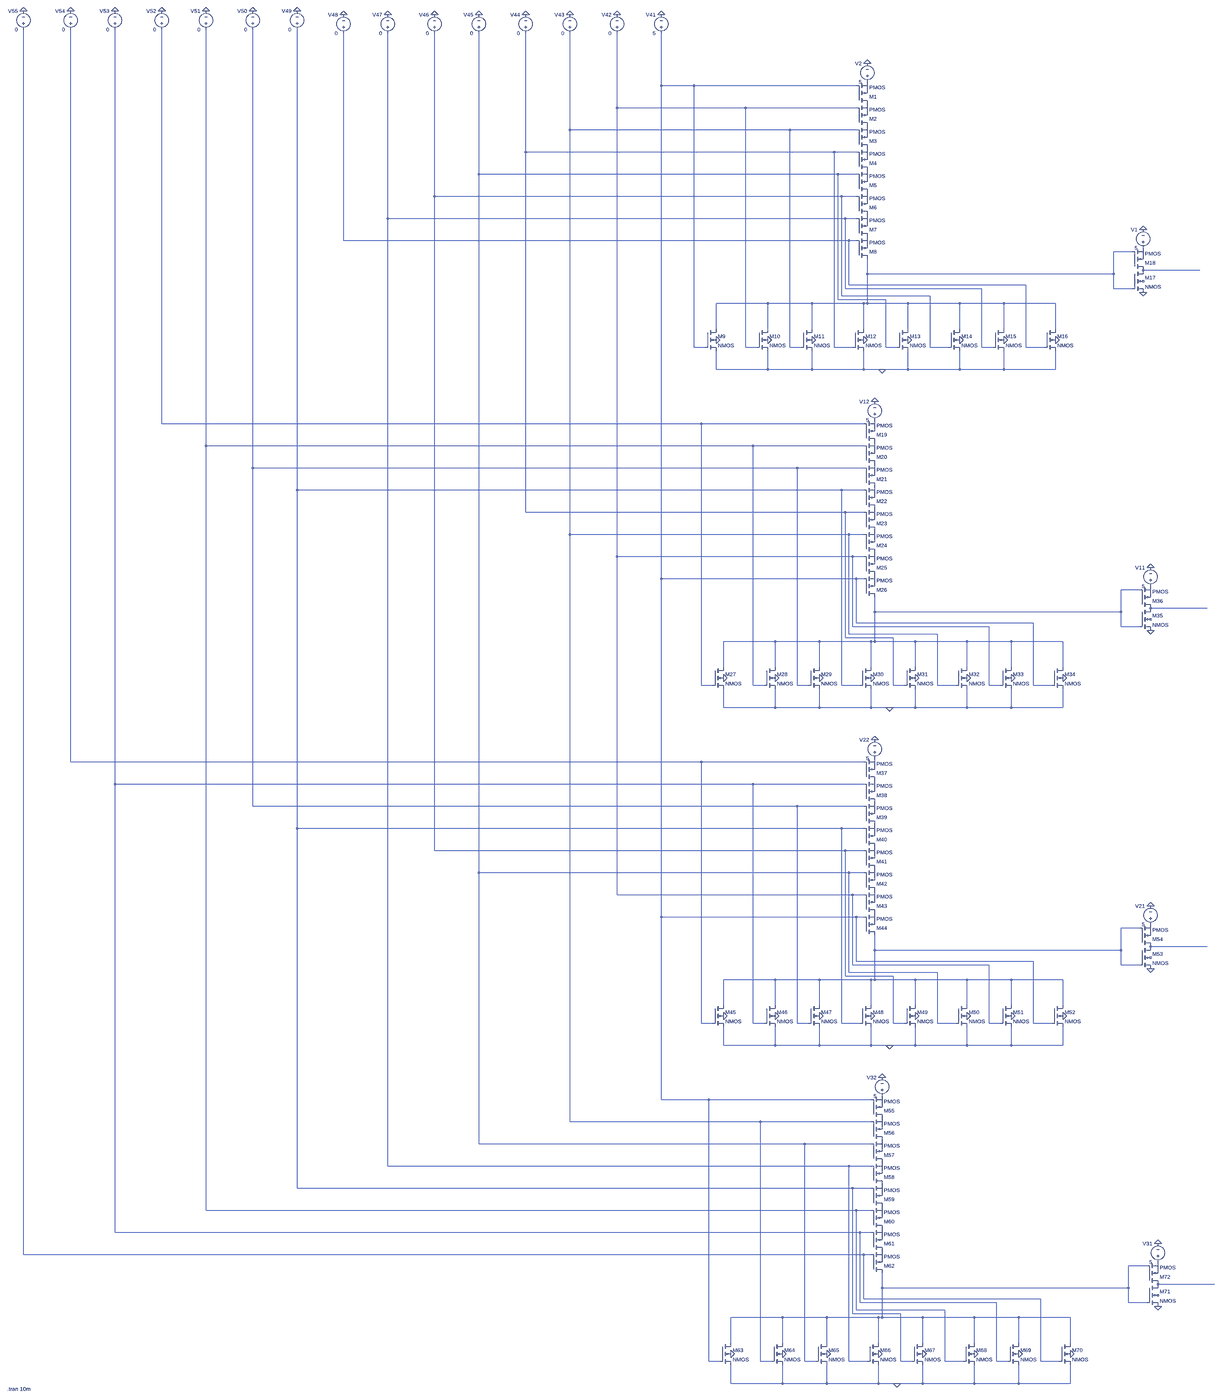
[diagram p0: schematic total.asc, whole sheet]
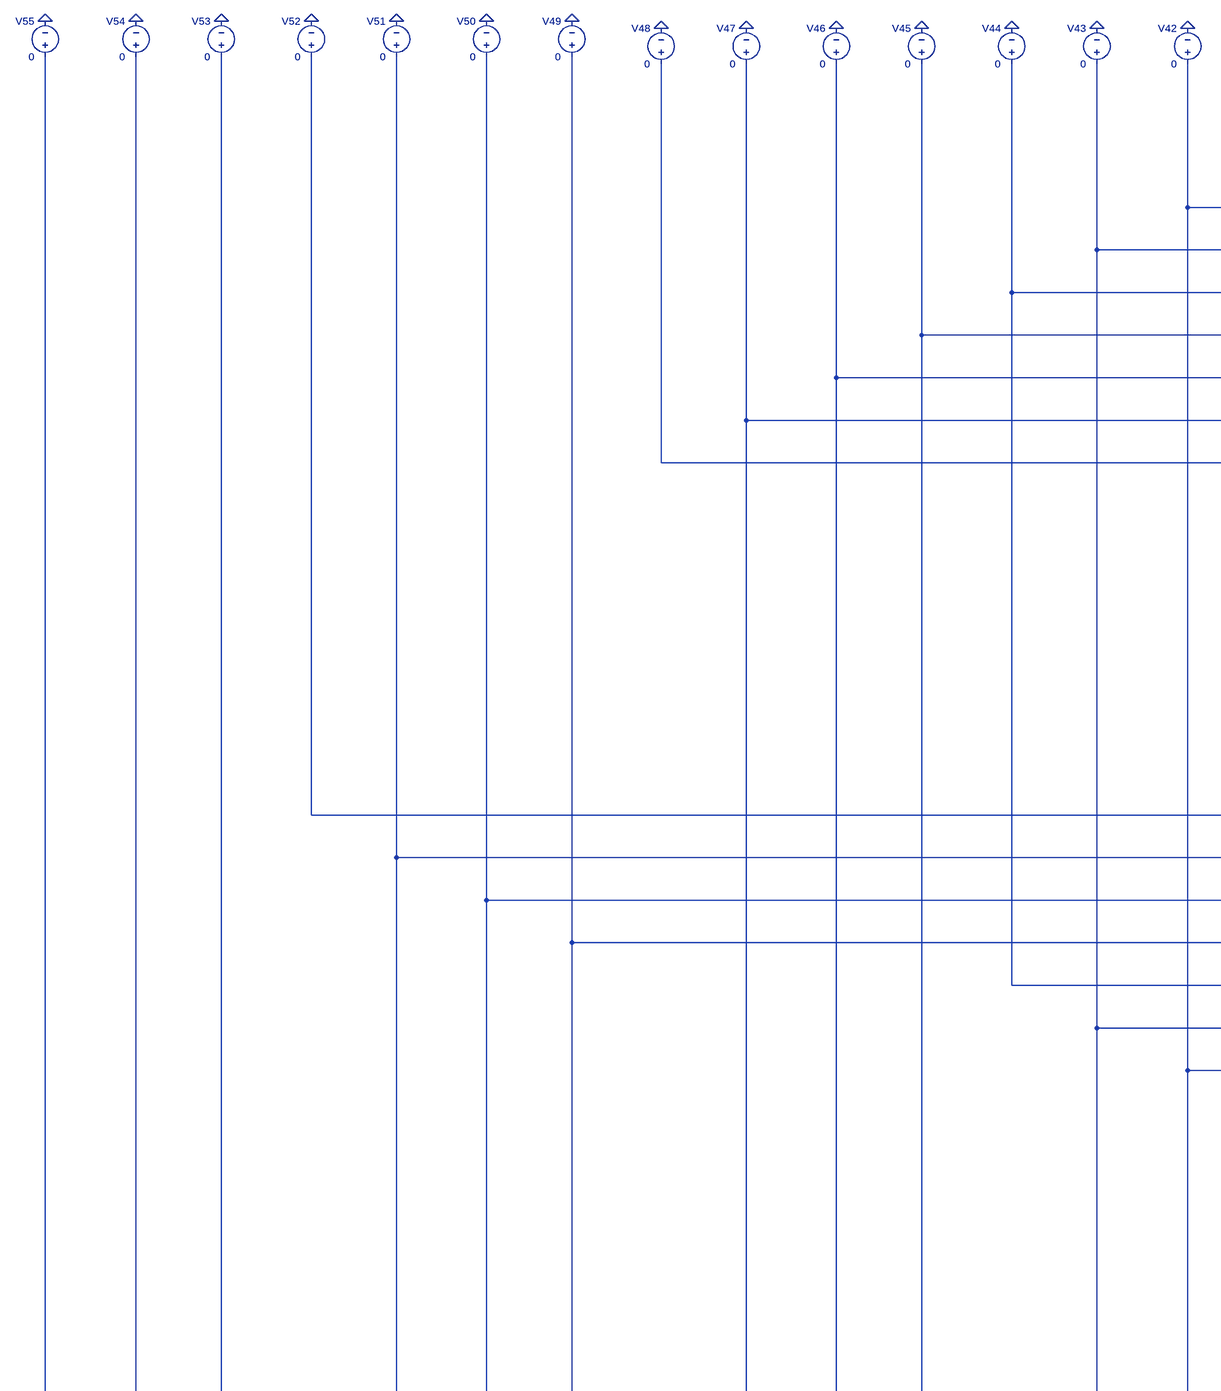
[diagram p1: schematic total.asc, part, row 1 of 2, column 1 of 2]
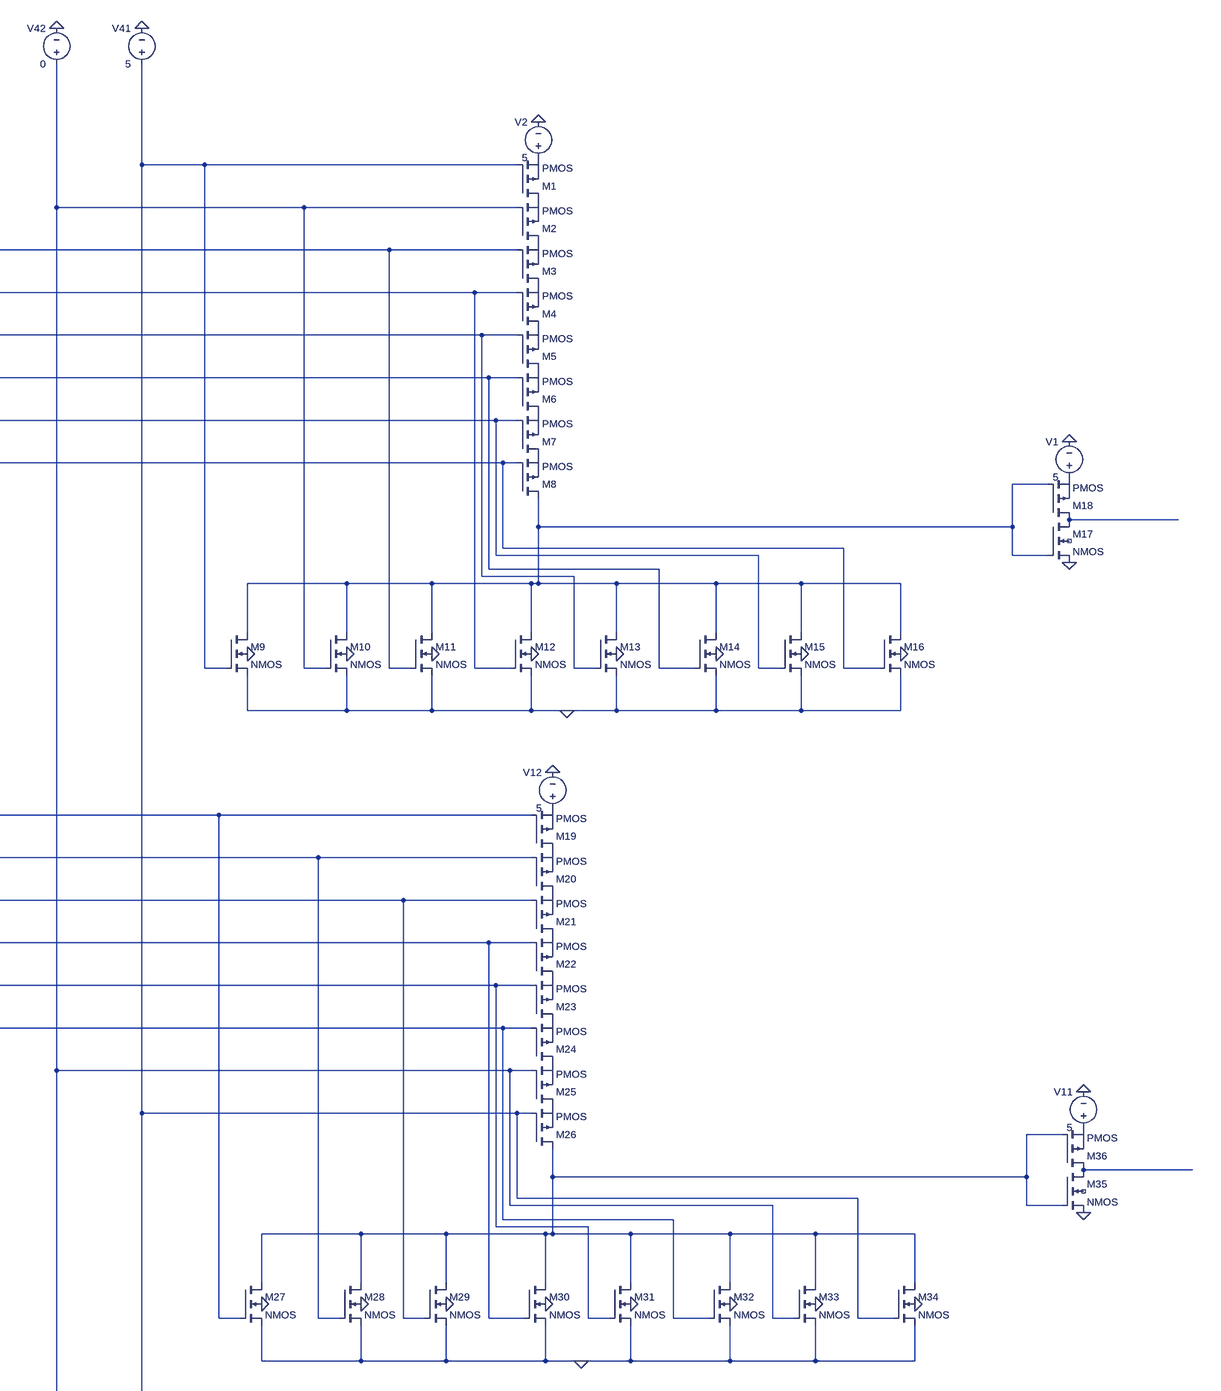
[diagram p2: schematic total.asc, part, row 1 of 2, column 2 of 2]
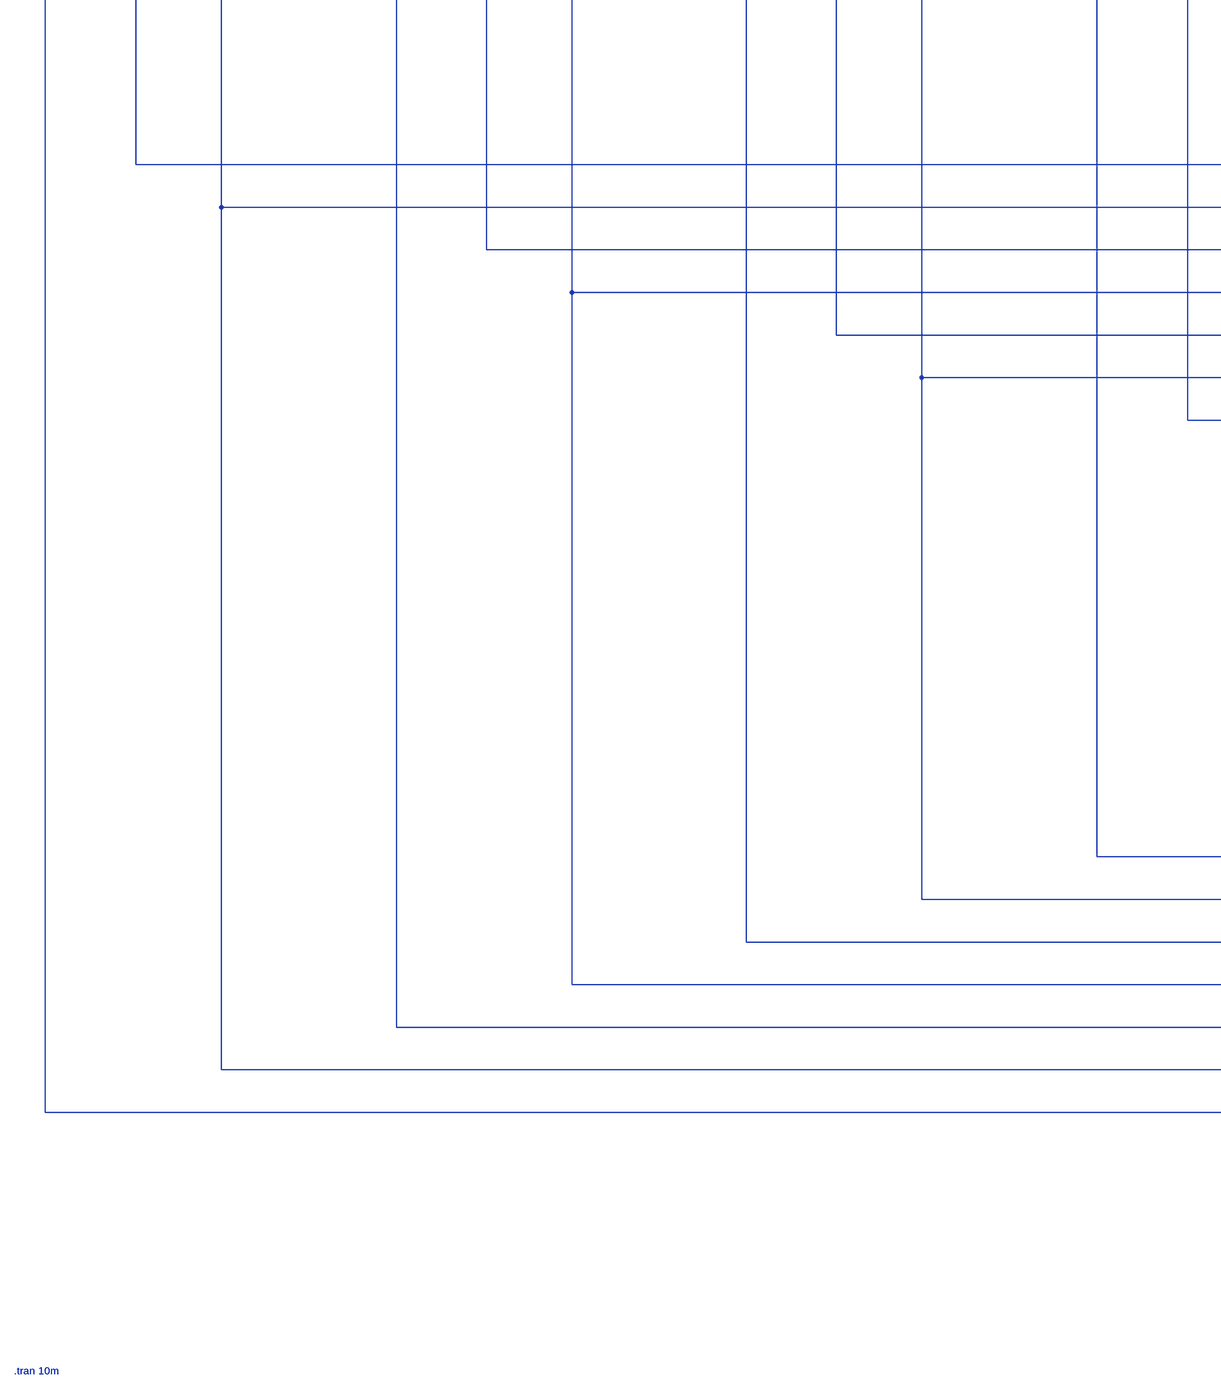
[diagram p3: schematic total.asc, part, row 2 of 2, column 1 of 2]
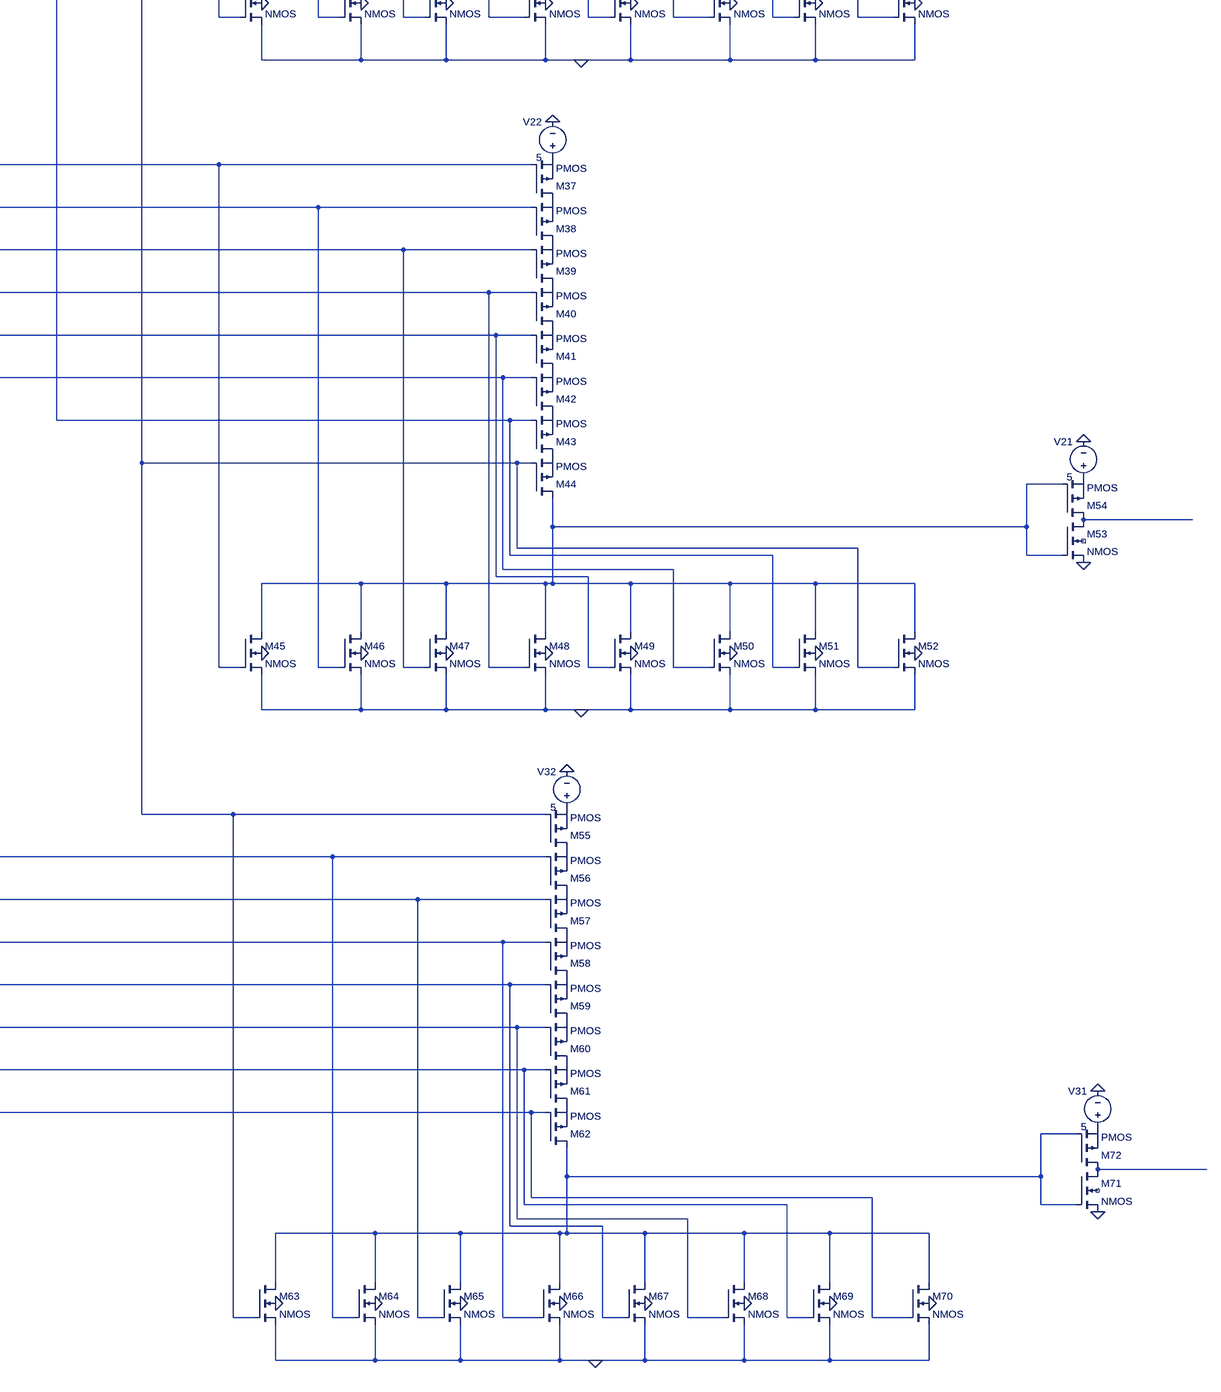
[diagram p4: schematic total.asc, part, row 2 of 2, column 2 of 2]
total.asc, the LTspice schematic file:
Version 4
SHEET 1 2260 6148
WIRE -1600 -384 -1600 -640
WIRE -448 -384 -1600 -384
WIRE 256 -384 -448 -384
WIRE -1792 -288 -1792 -640
WIRE -224 -288 -1792 -288
WIRE 256 -288 -224 -288
WIRE -2000 -192 -2000 -640
WIRE -32 -192 -2000 -192
WIRE 256 -192 -32 -192
WIRE -2192 -96 -2192 -640
WIRE 160 -96 -2192 -96
WIRE 256 -96 160 -96
WIRE -2400 0 -2400 -640
WIRE 176 0 -2400 0
WIRE 256 0 176 0
WIRE -2592 96 -2592 -640
WIRE 192 96 -2592 96
WIRE 256 96 192 96
WIRE -2800 192 -2800 -640
WIRE 208 192 -2800 192
WIRE 256 192 208 192
WIRE -2992 288 -2992 -640
WIRE 224 288 -2992 288
WIRE 256 288 224 288
WIRE 1856 336 1776 336
WIRE 2192 416 1904 416
WIRE 304 432 304 368
WIRE 1776 432 1776 336
WIRE 1776 432 304 432
WIRE 224 480 224 288
WIRE 992 480 224 480
WIRE 208 496 208 192
WIRE 800 496 208 496
WIRE 1776 496 1776 432
WIRE 1856 496 1776 496
WIRE 192 528 192 96
WIRE 576 528 192 528
WIRE 176 544 176 0
WIRE 384 544 176 544
WIRE -128 560 -352 560
WIRE 64 560 -128 560
WIRE 288 560 64 560
WIRE 304 560 304 432
WIRE 304 560 288 560
WIRE 480 560 304 560
WIRE 704 560 480 560
WIRE 896 560 704 560
WIRE 1120 560 896 560
WIRE -352 672 -352 560
WIRE -128 672 -128 560
WIRE 64 672 64 560
WIRE 288 672 288 560
WIRE 480 672 480 560
WIRE 704 672 704 560
WIRE 896 672 896 560
WIRE 1120 672 1120 560
WIRE -448 752 -448 -384
WIRE -400 752 -448 752
WIRE -224 752 -224 -288
WIRE -176 752 -224 752
WIRE -32 752 -32 -192
WIRE 16 752 -32 752
WIRE 160 752 160 -96
WIRE 240 752 160 752
WIRE 384 752 384 544
WIRE 432 752 384 752
WIRE 576 752 576 528
WIRE 656 752 576 752
WIRE 800 752 800 496
WIRE 848 752 800 752
WIRE 992 752 992 480
WIRE 1072 752 992 752
WIRE -352 848 -352 768
WIRE -128 848 -128 768
WIRE -128 848 -352 848
WIRE 64 848 64 768
WIRE 64 848 -128 848
WIRE 288 848 288 768
WIRE 288 848 64 848
WIRE 368 848 288 848
WIRE 480 848 480 768
WIRE 480 848 368 848
WIRE 704 848 704 768
WIRE 704 848 480 848
WIRE 896 848 896 768
WIRE 896 848 704 848
WIRE 1120 848 1120 768
WIRE 1120 848 896 848
WIRE -3792 1296 -3792 -656
WIRE -416 1296 -3792 1296
WIRE 288 1296 -416 1296
WIRE -3600 1392 -3600 -656
WIRE -192 1392 -3600 1392
WIRE 288 1392 -192 1392
WIRE -3392 1488 -3392 -656
WIRE 0 1488 -3392 1488
WIRE 288 1488 0 1488
WIRE -3200 1584 -3200 -656
WIRE 192 1584 -3200 1584
WIRE 288 1584 192 1584
WIRE -2192 1680 -2192 -96
WIRE 208 1680 -2192 1680
WIRE 288 1680 208 1680
WIRE -2000 1776 -2000 -192
WIRE 224 1776 -2000 1776
WIRE 288 1776 224 1776
WIRE -1792 1872 -1792 -288
WIRE 240 1872 -1792 1872
WIRE 288 1872 240 1872
WIRE -1600 1968 -1600 -384
WIRE 256 1968 -1600 1968
WIRE 288 1968 256 1968
WIRE 1888 2016 1808 2016
WIRE 2224 2096 1936 2096
WIRE 336 2112 336 2048
WIRE 1808 2112 1808 2016
WIRE 1808 2112 336 2112
WIRE 256 2160 256 1968
WIRE 1024 2160 256 2160
WIRE 240 2176 240 1872
WIRE 832 2176 240 2176
WIRE 1808 2176 1808 2112
WIRE 1888 2176 1808 2176
WIRE 224 2208 224 1776
WIRE 608 2208 224 2208
WIRE 208 2224 208 1680
WIRE 416 2224 208 2224
WIRE -96 2240 -320 2240
WIRE 96 2240 -96 2240
WIRE 320 2240 96 2240
WIRE 336 2240 336 2112
WIRE 336 2240 320 2240
WIRE 512 2240 336 2240
WIRE 736 2240 512 2240
WIRE 928 2240 736 2240
WIRE 1152 2240 928 2240
WIRE -320 2352 -320 2240
WIRE -96 2352 -96 2240
WIRE 96 2352 96 2240
WIRE 320 2352 320 2240
WIRE 512 2352 512 2240
WIRE 736 2352 736 2240
WIRE 928 2352 928 2240
WIRE 1152 2352 1152 2240
WIRE -416 2432 -416 1296
WIRE -368 2432 -416 2432
WIRE -192 2432 -192 1392
WIRE -144 2432 -192 2432
WIRE 0 2432 0 1488
WIRE 48 2432 0 2432
WIRE 192 2432 192 1584
WIRE 272 2432 192 2432
WIRE 416 2432 416 2224
WIRE 464 2432 416 2432
WIRE 608 2432 608 2208
WIRE 688 2432 608 2432
WIRE 832 2432 832 2176
WIRE 880 2432 832 2432
WIRE 1024 2432 1024 2160
WIRE 1104 2432 1024 2432
WIRE -320 2528 -320 2448
WIRE -96 2528 -96 2448
WIRE -96 2528 -320 2528
WIRE 96 2528 96 2448
WIRE 96 2528 -96 2528
WIRE 320 2528 320 2448
WIRE 320 2528 96 2528
WIRE 400 2528 320 2528
WIRE 512 2528 512 2448
WIRE 512 2528 400 2528
WIRE 736 2528 736 2448
WIRE 736 2528 512 2528
WIRE 928 2528 928 2448
WIRE 928 2528 736 2528
WIRE 1152 2528 1152 2448
WIRE 1152 2528 928 2528
WIRE -4192 2960 -4192 -656
WIRE -416 2960 -4192 2960
WIRE 288 2960 -416 2960
WIRE -4000 3056 -4000 -656
WIRE -192 3056 -4000 3056
WIRE 288 3056 -192 3056
WIRE -3392 3152 -3392 1488
WIRE 0 3152 -3392 3152
WIRE 288 3152 0 3152
WIRE -3200 3248 -3200 1584
WIRE 192 3248 -3200 3248
WIRE 288 3248 192 3248
WIRE -2592 3344 -2592 96
WIRE 208 3344 -2592 3344
WIRE 288 3344 208 3344
WIRE -2400 3440 -2400 0
WIRE 224 3440 -2400 3440
WIRE 288 3440 224 3440
WIRE -1792 3536 -1792 1872
WIRE 240 3536 -1792 3536
WIRE 288 3536 240 3536
WIRE -1600 3632 -1600 1968
WIRE 256 3632 -1600 3632
WIRE 288 3632 256 3632
WIRE 1888 3680 1808 3680
WIRE 2224 3760 1936 3760
WIRE 336 3776 336 3712
WIRE 1808 3776 1808 3680
WIRE 1808 3776 336 3776
WIRE 256 3824 256 3632
WIRE 1024 3824 256 3824
WIRE 240 3840 240 3536
WIRE 832 3840 240 3840
WIRE 1808 3840 1808 3776
WIRE 1888 3840 1808 3840
WIRE 224 3872 224 3440
WIRE 608 3872 224 3872
WIRE 208 3888 208 3344
WIRE 416 3888 208 3888
WIRE -96 3904 -320 3904
WIRE 96 3904 -96 3904
WIRE 320 3904 96 3904
WIRE 336 3904 336 3776
WIRE 336 3904 320 3904
WIRE 512 3904 336 3904
WIRE 736 3904 512 3904
WIRE 928 3904 736 3904
WIRE 1152 3904 928 3904
WIRE -320 4016 -320 3904
WIRE -96 4016 -96 3904
WIRE 96 4016 96 3904
WIRE 320 4016 320 3904
WIRE 512 4016 512 3904
WIRE 736 4016 736 3904
WIRE 928 4016 928 3904
WIRE 1152 4016 1152 3904
WIRE -416 4096 -416 2960
WIRE -368 4096 -416 4096
WIRE -192 4096 -192 3056
WIRE -144 4096 -192 4096
WIRE 0 4096 0 3152
WIRE 48 4096 0 4096
WIRE 192 4096 192 3248
WIRE 272 4096 192 4096
WIRE 416 4096 416 3888
WIRE 464 4096 416 4096
WIRE 608 4096 608 3872
WIRE 688 4096 608 4096
WIRE 832 4096 832 3840
WIRE 880 4096 832 4096
WIRE 1024 4096 1024 3824
WIRE 1104 4096 1024 4096
WIRE -320 4192 -320 4112
WIRE -96 4192 -96 4112
WIRE -96 4192 -320 4192
WIRE 96 4192 96 4112
WIRE 96 4192 -96 4192
WIRE 320 4192 320 4112
WIRE 320 4192 96 4192
WIRE 400 4192 320 4192
WIRE 512 4192 512 4112
WIRE 512 4192 400 4192
WIRE 736 4192 736 4112
WIRE 736 4192 512 4192
WIRE 928 4192 928 4112
WIRE 928 4192 736 4192
WIRE 1152 4192 1152 4112
WIRE 1152 4192 928 4192
WIRE -1600 4640 -1600 3632
WIRE -384 4640 -1600 4640
WIRE 320 4640 -384 4640
WIRE -2000 4736 -2000 1776
WIRE -160 4736 -2000 4736
WIRE 320 4736 -160 4736
WIRE -2400 4832 -2400 3440
WIRE 32 4832 -2400 4832
WIRE 320 4832 32 4832
WIRE -2800 4928 -2800 192
WIRE 224 4928 -2800 4928
WIRE 320 4928 224 4928
WIRE -3200 5024 -3200 3248
WIRE 240 5024 -3200 5024
WIRE 320 5024 240 5024
WIRE -3600 5120 -3600 1392
WIRE 256 5120 -3600 5120
WIRE 320 5120 256 5120
WIRE -4000 5216 -4000 3056
WIRE 272 5216 -4000 5216
WIRE 320 5216 272 5216
WIRE -4400 5312 -4400 -656
WIRE 288 5312 -4400 5312
WIRE 320 5312 288 5312
WIRE 1920 5360 1840 5360
WIRE 2256 5440 1968 5440
WIRE 368 5456 368 5392
WIRE 1840 5456 1840 5360
WIRE 1840 5456 368 5456
WIRE 288 5504 288 5312
WIRE 1056 5504 288 5504
WIRE 272 5520 272 5216
WIRE 864 5520 272 5520
WIRE 1840 5520 1840 5456
WIRE 1920 5520 1840 5520
WIRE 256 5552 256 5120
WIRE 640 5552 256 5552
WIRE 240 5568 240 5024
WIRE 448 5568 240 5568
WIRE -64 5584 -288 5584
WIRE 128 5584 -64 5584
WIRE 352 5584 128 5584
WIRE 368 5584 368 5456
WIRE 368 5584 352 5584
WIRE 544 5584 368 5584
WIRE 768 5584 544 5584
WIRE 960 5584 768 5584
WIRE 1184 5584 960 5584
WIRE -288 5696 -288 5584
WIRE -64 5696 -64 5584
WIRE 128 5696 128 5584
WIRE 352 5696 352 5584
WIRE 544 5696 544 5584
WIRE 768 5696 768 5584
WIRE 960 5696 960 5584
WIRE 1184 5696 1184 5584
WIRE -384 5776 -384 4640
WIRE -336 5776 -384 5776
WIRE -160 5776 -160 4736
WIRE -112 5776 -160 5776
WIRE 32 5776 32 4832
WIRE 80 5776 32 5776
WIRE 224 5776 224 4928
WIRE 304 5776 224 5776
WIRE 448 5776 448 5568
WIRE 496 5776 448 5776
WIRE 640 5776 640 5552
WIRE 720 5776 640 5776
WIRE 864 5776 864 5520
WIRE 912 5776 864 5776
WIRE 1056 5776 1056 5504
WIRE 1136 5776 1056 5776
WIRE -288 5872 -288 5792
WIRE -64 5872 -64 5792
WIRE -64 5872 -288 5872
WIRE 128 5872 128 5792
WIRE 128 5872 -64 5872
WIRE 352 5872 352 5792
WIRE 352 5872 128 5872
WIRE 432 5872 352 5872
WIRE 544 5872 544 5792
WIRE 544 5872 432 5872
WIRE 768 5872 768 5792
WIRE 768 5872 544 5872
WIRE 960 5872 960 5792
WIRE 960 5872 768 5872
WIRE 1184 5872 1184 5792
WIRE 1184 5872 960 5872
FLAG -352 720 0
FLAG -128 720 0
FLAG 64 720 0
FLAG 288 720 0
FLAG 480 720 0
FLAG 704 720 0
FLAG 896 720 0
FLAG 1120 720 0
FLAG 368 848 0
FLAG 1904 512 0
FLAG 1904 240 0
FLAG 304 -480 0
FLAG -320 2400 0
FLAG -96 2400 0
FLAG 96 2400 0
FLAG 320 2400 0
FLAG 512 2400 0
FLAG 736 2400 0
FLAG 928 2400 0
FLAG 1152 2400 0
FLAG 400 2528 0
FLAG 1936 2192 0
FLAG 1936 1920 0
FLAG 336 1200 0
FLAG -320 4064 0
FLAG -96 4064 0
FLAG 96 4064 0
FLAG 320 4064 0
FLAG 512 4064 0
FLAG 736 4064 0
FLAG 928 4064 0
FLAG 1152 4064 0
FLAG 400 4192 0
FLAG 1936 3856 0
FLAG 1936 3584 0
FLAG 336 2864 0
FLAG -288 5744 0
FLAG -64 5744 0
FLAG 128 5744 0
FLAG 352 5744 0
FLAG 544 5744 0
FLAG 768 5744 0
FLAG 960 5744 0
FLAG 1184 5744 0
FLAG 432 5872 0
FLAG 1968 5536 0
FLAG 1968 5264 0
FLAG 368 4544 0
FLAG -1600 -720 0
FLAG -1792 -720 0
FLAG -2000 -720 0
FLAG -2192 -720 0
FLAG -2400 -720 0
FLAG -2592 -720 0
FLAG -2800 -720 0
FLAG -2992 -720 0
FLAG -3200 -736 0
FLAG -3392 -736 0
FLAG -3600 -736 0
FLAG -3792 -736 0
FLAG -4000 -736 0
FLAG -4192 -736 0
FLAG -4400 -736 0
SYMBOL pmos 256 -304 M180
SYMATTR InstName M1
SYMBOL pmos 256 -208 M180
SYMATTR InstName M2
SYMBOL pmos 256 -112 M180
SYMATTR InstName M3
SYMBOL pmos 256 -16 M180
SYMATTR InstName M4
SYMBOL pmos 256 80 M180
SYMATTR InstName M5
SYMBOL pmos 256 176 M180
SYMATTR InstName M6
SYMBOL pmos 256 272 M180
SYMATTR InstName M7
SYMBOL pmos 256 368 M180
SYMATTR InstName M8
SYMBOL nmos4 -400 672 R0
SYMATTR InstName M9
SYMBOL nmos4 -176 672 R0
SYMATTR InstName M10
SYMBOL nmos4 16 672 R0
SYMATTR InstName M11
SYMBOL nmos4 240 672 R0
SYMATTR InstName M12
SYMBOL nmos4 432 672 R0
SYMATTR InstName M13
SYMBOL nmos4 656 672 R0
SYMATTR InstName M14
SYMBOL nmos4 848 672 R0
SYMATTR InstName M15
SYMBOL nmos4 1072 672 R0
SYMATTR InstName M16
SYMBOL nmos4 1856 416 R0
SYMATTR InstName M17
SYMBOL pmos 1856 416 M180
SYMATTR InstName M18
SYMBOL voltage 1904 336 R180
WINDOW 0 24 96 Left 2
WINDOW 3 24 16 Left 2
WINDOW 123 0 0 Left 0
WINDOW 39 0 0 Left 0
SYMATTR InstName V1
SYMATTR Value 5
SYMBOL voltage 304 -384 R180
WINDOW 0 24 96 Left 2
WINDOW 3 24 16 Left 2
WINDOW 123 0 0 Left 0
WINDOW 39 0 0 Left 0
SYMATTR InstName V2
SYMATTR Value 5
SYMBOL pmos 288 1376 M180
SYMATTR InstName M19
SYMBOL pmos 288 1472 M180
SYMATTR InstName M20
SYMBOL pmos 288 1568 M180
SYMATTR InstName M21
SYMBOL pmos 288 1664 M180
SYMATTR InstName M22
SYMBOL pmos 288 1760 M180
SYMATTR InstName M23
SYMBOL pmos 288 1856 M180
SYMATTR InstName M24
SYMBOL pmos 288 1952 M180
SYMATTR InstName M25
SYMBOL pmos 288 2048 M180
SYMATTR InstName M26
SYMBOL nmos4 -368 2352 R0
SYMATTR InstName M27
SYMBOL nmos4 -144 2352 R0
SYMATTR InstName M28
SYMBOL nmos4 48 2352 R0
SYMATTR InstName M29
SYMBOL nmos4 272 2352 R0
SYMATTR InstName M30
SYMBOL nmos4 464 2352 R0
SYMATTR InstName M31
SYMBOL nmos4 688 2352 R0
SYMATTR InstName M32
SYMBOL nmos4 880 2352 R0
SYMATTR InstName M33
SYMBOL nmos4 1104 2352 R0
SYMATTR InstName M34
SYMBOL nmos4 1888 2096 R0
SYMATTR InstName M35
SYMBOL pmos 1888 2096 M180
SYMATTR InstName M36
SYMBOL voltage 1936 2016 R180
WINDOW 0 24 96 Left 2
WINDOW 3 24 16 Left 2
WINDOW 123 0 0 Left 0
WINDOW 39 0 0 Left 0
SYMATTR InstName V11
SYMATTR Value 5
SYMBOL voltage 336 1296 R180
WINDOW 0 24 96 Left 2
WINDOW 3 24 16 Left 2
WINDOW 123 0 0 Left 0
WINDOW 39 0 0 Left 0
SYMATTR InstName V12
SYMATTR Value 5
SYMBOL pmos 288 3040 M180
SYMATTR InstName M37
SYMBOL pmos 288 3136 M180
SYMATTR InstName M38
SYMBOL pmos 288 3232 M180
SYMATTR InstName M39
SYMBOL pmos 288 3328 M180
SYMATTR InstName M40
SYMBOL pmos 288 3424 M180
SYMATTR InstName M41
SYMBOL pmos 288 3520 M180
SYMATTR InstName M42
SYMBOL pmos 288 3616 M180
SYMATTR InstName M43
SYMBOL pmos 288 3712 M180
SYMATTR InstName M44
SYMBOL nmos4 -368 4016 R0
SYMATTR InstName M45
SYMBOL nmos4 -144 4016 R0
SYMATTR InstName M46
SYMBOL nmos4 48 4016 R0
SYMATTR InstName M47
SYMBOL nmos4 272 4016 R0
SYMATTR InstName M48
SYMBOL nmos4 464 4016 R0
SYMATTR InstName M49
SYMBOL nmos4 688 4016 R0
SYMATTR InstName M50
SYMBOL nmos4 880 4016 R0
SYMATTR InstName M51
SYMBOL nmos4 1104 4016 R0
SYMATTR InstName M52
SYMBOL nmos4 1888 3760 R0
SYMATTR InstName M53
SYMBOL pmos 1888 3760 M180
SYMATTR InstName M54
SYMBOL voltage 1936 3680 R180
WINDOW 0 24 96 Left 2
WINDOW 3 24 16 Left 2
WINDOW 123 0 0 Left 0
WINDOW 39 0 0 Left 0
SYMATTR InstName V21
SYMATTR Value 5
SYMBOL voltage 336 2960 R180
WINDOW 0 24 96 Left 2
WINDOW 3 24 16 Left 2
WINDOW 123 0 0 Left 0
WINDOW 39 0 0 Left 0
SYMATTR InstName V22
SYMATTR Value 5
SYMBOL pmos 320 4720 M180
SYMATTR InstName M55
SYMBOL pmos 320 4816 M180
SYMATTR InstName M56
SYMBOL pmos 320 4912 M180
SYMATTR InstName M57
SYMBOL pmos 320 5008 M180
SYMATTR InstName M58
SYMBOL pmos 320 5104 M180
SYMATTR InstName M59
SYMBOL pmos 320 5200 M180
SYMATTR InstName M60
SYMBOL pmos 320 5296 M180
SYMATTR InstName M61
SYMBOL pmos 320 5392 M180
SYMATTR InstName M62
SYMBOL nmos4 -336 5696 R0
SYMATTR InstName M63
SYMBOL nmos4 -112 5696 R0
SYMATTR InstName M64
SYMBOL nmos4 80 5696 R0
SYMATTR InstName M65
SYMBOL nmos4 304 5696 R0
SYMATTR InstName M66
SYMBOL nmos4 496 5696 R0
SYMATTR InstName M67
SYMBOL nmos4 720 5696 R0
SYMATTR InstName M68
SYMBOL nmos4 912 5696 R0
SYMATTR InstName M69
SYMBOL nmos4 1136 5696 R0
SYMATTR InstName M70
SYMBOL nmos4 1920 5440 R0
SYMATTR InstName M71
SYMBOL pmos 1920 5440 M180
SYMATTR InstName M72
SYMBOL voltage 1968 5360 R180
WINDOW 0 24 96 Left 2
WINDOW 3 24 16 Left 2
WINDOW 123 0 0 Left 0
WINDOW 39 0 0 Left 0
SYMATTR InstName V31
SYMATTR Value 5
SYMBOL voltage 368 4640 R180
WINDOW 0 24 96 Left 2
WINDOW 3 24 16 Left 2
WINDOW 123 0 0 Left 0
WINDOW 39 0 0 Left 0
SYMATTR InstName V32
SYMATTR Value 5
SYMBOL voltage -1600 -624 R180
WINDOW 0 24 96 Left 2
WINDOW 3 24 16 Left 2
WINDOW 123 0 0 Left 0
WINDOW 39 0 0 Left 0
SYMATTR InstName V41
SYMATTR Value 5
SYMBOL voltage -1792 -624 R180
WINDOW 0 24 96 Left 2
WINDOW 3 24 16 Left 2
WINDOW 123 0 0 Left 0
WINDOW 39 0 0 Left 0
SYMATTR InstName V42
SYMATTR Value 0
SYMBOL voltage -2000 -624 R180
WINDOW 0 24 96 Left 2
WINDOW 3 24 16 Left 2
WINDOW 123 0 0 Left 0
WINDOW 39 0 0 Left 0
SYMATTR InstName V43
SYMATTR Value 0
SYMBOL voltage -2192 -624 R180
WINDOW 0 24 96 Left 2
WINDOW 3 24 16 Left 2
WINDOW 123 0 0 Left 0
WINDOW 39 0 0 Left 0
SYMATTR InstName V44
SYMATTR Value 0
SYMBOL voltage -2400 -624 R180
WINDOW 0 24 96 Left 2
WINDOW 3 24 16 Left 2
WINDOW 123 0 0 Left 0
WINDOW 39 0 0 Left 0
SYMATTR InstName V45
SYMATTR Value 0
SYMBOL voltage -2592 -624 R180
WINDOW 0 24 96 Left 2
WINDOW 3 24 16 Left 2
WINDOW 123 0 0 Left 0
WINDOW 39 0 0 Left 0
SYMATTR InstName V46
SYMATTR Value 0
SYMBOL voltage -2800 -624 R180
WINDOW 0 24 96 Left 2
WINDOW 3 24 16 Left 2
WINDOW 123 0 0 Left 0
WINDOW 39 0 0 Left 0
SYMATTR InstName V47
SYMATTR Value 0
SYMBOL voltage -2992 -624 R180
WINDOW 0 24 96 Left 2
WINDOW 3 24 16 Left 2
WINDOW 123 0 0 Left 0
WINDOW 39 0 0 Left 0
SYMATTR InstName V48
SYMATTR Value 0
SYMBOL voltage -3200 -640 R180
WINDOW 0 24 96 Left 2
WINDOW 3 24 16 Left 2
WINDOW 123 0 0 Left 0
WINDOW 39 0 0 Left 0
SYMATTR InstName V49
SYMATTR Value 0
SYMBOL voltage -3392 -640 R180
WINDOW 0 24 96 Left 2
WINDOW 3 24 16 Left 2
WINDOW 123 0 0 Left 0
WINDOW 39 0 0 Left 0
SYMATTR InstName V50
SYMATTR Value 0
SYMBOL voltage -3600 -640 R180
WINDOW 0 24 96 Left 2
WINDOW 3 24 16 Left 2
WINDOW 123 0 0 Left 0
WINDOW 39 0 0 Left 0
SYMATTR InstName V51
SYMATTR Value 0
SYMBOL voltage -3792 -640 R180
WINDOW 0 24 96 Left 2
WINDOW 3 24 16 Left 2
WINDOW 123 0 0 Left 0
WINDOW 39 0 0 Left 0
SYMATTR InstName V52
SYMATTR Value 0
SYMBOL voltage -4000 -640 R180
WINDOW 0 24 96 Left 2
WINDOW 3 24 16 Left 2
WINDOW 123 0 0 Left 0
WINDOW 39 0 0 Left 0
SYMATTR InstName V53
SYMATTR Value 0
SYMBOL voltage -4192 -640 R180
WINDOW 0 24 96 Left 2
WINDOW 3 24 16 Left 2
WINDOW 123 0 0 Left 0
WINDOW 39 0 0 Left 0
SYMATTR InstName V54
SYMATTR Value 0
SYMBOL voltage -4400 -640 R180
WINDOW 0 24 96 Left 2
WINDOW 3 24 16 Left 2
WINDOW 123 0 0 Left 0
WINDOW 39 0 0 Left 0
SYMATTR InstName V55
SYMATTR Value 0
TEXT -4470 5896 Left 2 !.tran 10m

The netlist it stands for:
* total.asc
M1 P001 N001 P002 P002 PMOS
M2 P003 N002 P001 P001 PMOS
M3 P004 N003 P003 P003 PMOS
M4 P005 N004 P004 P004 PMOS
M5 P006 N005 P005 P005 PMOS
M6 P007 N006 P006 P006 PMOS
M7 P008 N007 P007 P007 PMOS
M8 N009 N008 P008 P008 PMOS
M9 N009 N001 0 0 NMOS
M10 N009 N002 0 0 NMOS
M11 N009 N003 0 0 NMOS
M12 N009 N004 0 0 NMOS
M13 N009 N005 0 0 NMOS
M14 N009 N006 0 0 NMOS
M15 N009 N007 0 0 NMOS
M16 N009 N008 0 0 NMOS
M17 N010 N009 0 NC_01 NMOS
M18 N010 N009 P009 P009 PMOS
V1 P009 0 5
V2 P002 0 5
M19 P010 N011 P011 P011 PMOS
M20 P012 N012 P010 P010 PMOS
M21 P013 N013 P012 P012 PMOS
M22 P014 N014 P013 P013 PMOS
M23 P015 N004 P014 P014 PMOS
M24 P016 N003 P015 P015 PMOS
M25 P017 N002 P016 P016 PMOS
M26 N015 N001 P017 P017 PMOS
M27 N015 N011 0 0 NMOS
M28 N015 N012 0 0 NMOS
M29 N015 N013 0 0 NMOS
M30 N015 N014 0 0 NMOS
M31 N015 N004 0 0 NMOS
M32 N015 N003 0 0 NMOS
M33 N015 N002 0 0 NMOS
M34 N015 N001 0 0 NMOS
M35 N016 N015 0 NC_02 NMOS
M36 N016 N015 P018 P018 PMOS
V11 P018 0 5
V12 P011 0 5
M37 P019 N017 P020 P020 PMOS
M38 P021 N018 P019 P019 PMOS
M39 P022 N013 P021 P021 PMOS
M40 P023 N014 P022 P022 PMOS
M41 P024 N006 P023 P023 PMOS
M42 P025 N005 P024 P024 PMOS
M43 P026 N002 P025 P025 PMOS
M44 N019 N001 P026 P026 PMOS
M45 N019 N017 0 0 NMOS
M46 N019 N018 0 0 NMOS
M47 N019 N013 0 0 NMOS
M48 N019 N014 0 0 NMOS
M49 N019 N006 0 0 NMOS
M50 N019 N005 0 0 NMOS
M51 N019 N002 0 0 NMOS
M52 N019 N001 0 0 NMOS
M53 N020 N019 0 NC_03 NMOS
M54 N020 N019 P027 P027 PMOS
V21 P027 0 5
V22 P020 0 5
M55 P028 N001 P029 P029 PMOS
M56 P030 N003 P028 P028 PMOS
M57 P031 N005 P030 P030 PMOS
M58 P032 N007 P031 P031 PMOS
M59 P033 N014 P032 P032 PMOS
M60 P034 N012 P033 P033 PMOS
M61 P035 N018 P034 P034 PMOS
M62 N022 N021 P035 P035 PMOS
M63 N022 N001 0 0 NMOS
M64 N022 N003 0 0 NMOS
M65 N022 N005 0 0 NMOS
M66 N022 N007 0 0 NMOS
M67 N022 N014 0 0 NMOS
M68 N022 N012 0 0 NMOS
M69 N022 N018 0 0 NMOS
M70 N022 N021 0 0 NMOS
M71 N023 N022 0 NC_04 NMOS
M72 N023 N022 P036 P036 PMOS
V31 P036 0 5
V32 P029 0 5
V41 N001 0 5
V42 N002 0 0
V43 N003 0 0
V44 N004 0 0
V45 N005 0 0
V46 N006 0 0
V47 N007 0 0
V48 N008 0 0
V49 N014 0 0
V50 N013 0 0
V51 N012 0 0
V52 N011 0 0
V53 N018 0 0
V54 N017 0 0
V55 N021 0 0
.model NMOS NMOS
.model PMOS PMOS
.lib standard.mos
.tran 10m
.backanno
.end